# Altium project LimeSDR-X3_1v2.PrjPcb (part 5 of 20)

## Sheet 11_LMS1_Power.SchDoc: LMS7002M power supply (LMS1)
size A3; Organization: Lime Microsystems; Address1: Surrey Tech Centre; Address2: Guildford GU2 7YG; Address3: Surrey; Address4: United Kingdom; Revision: 1.2; SheetNumber: 10; SheetTotal: 31
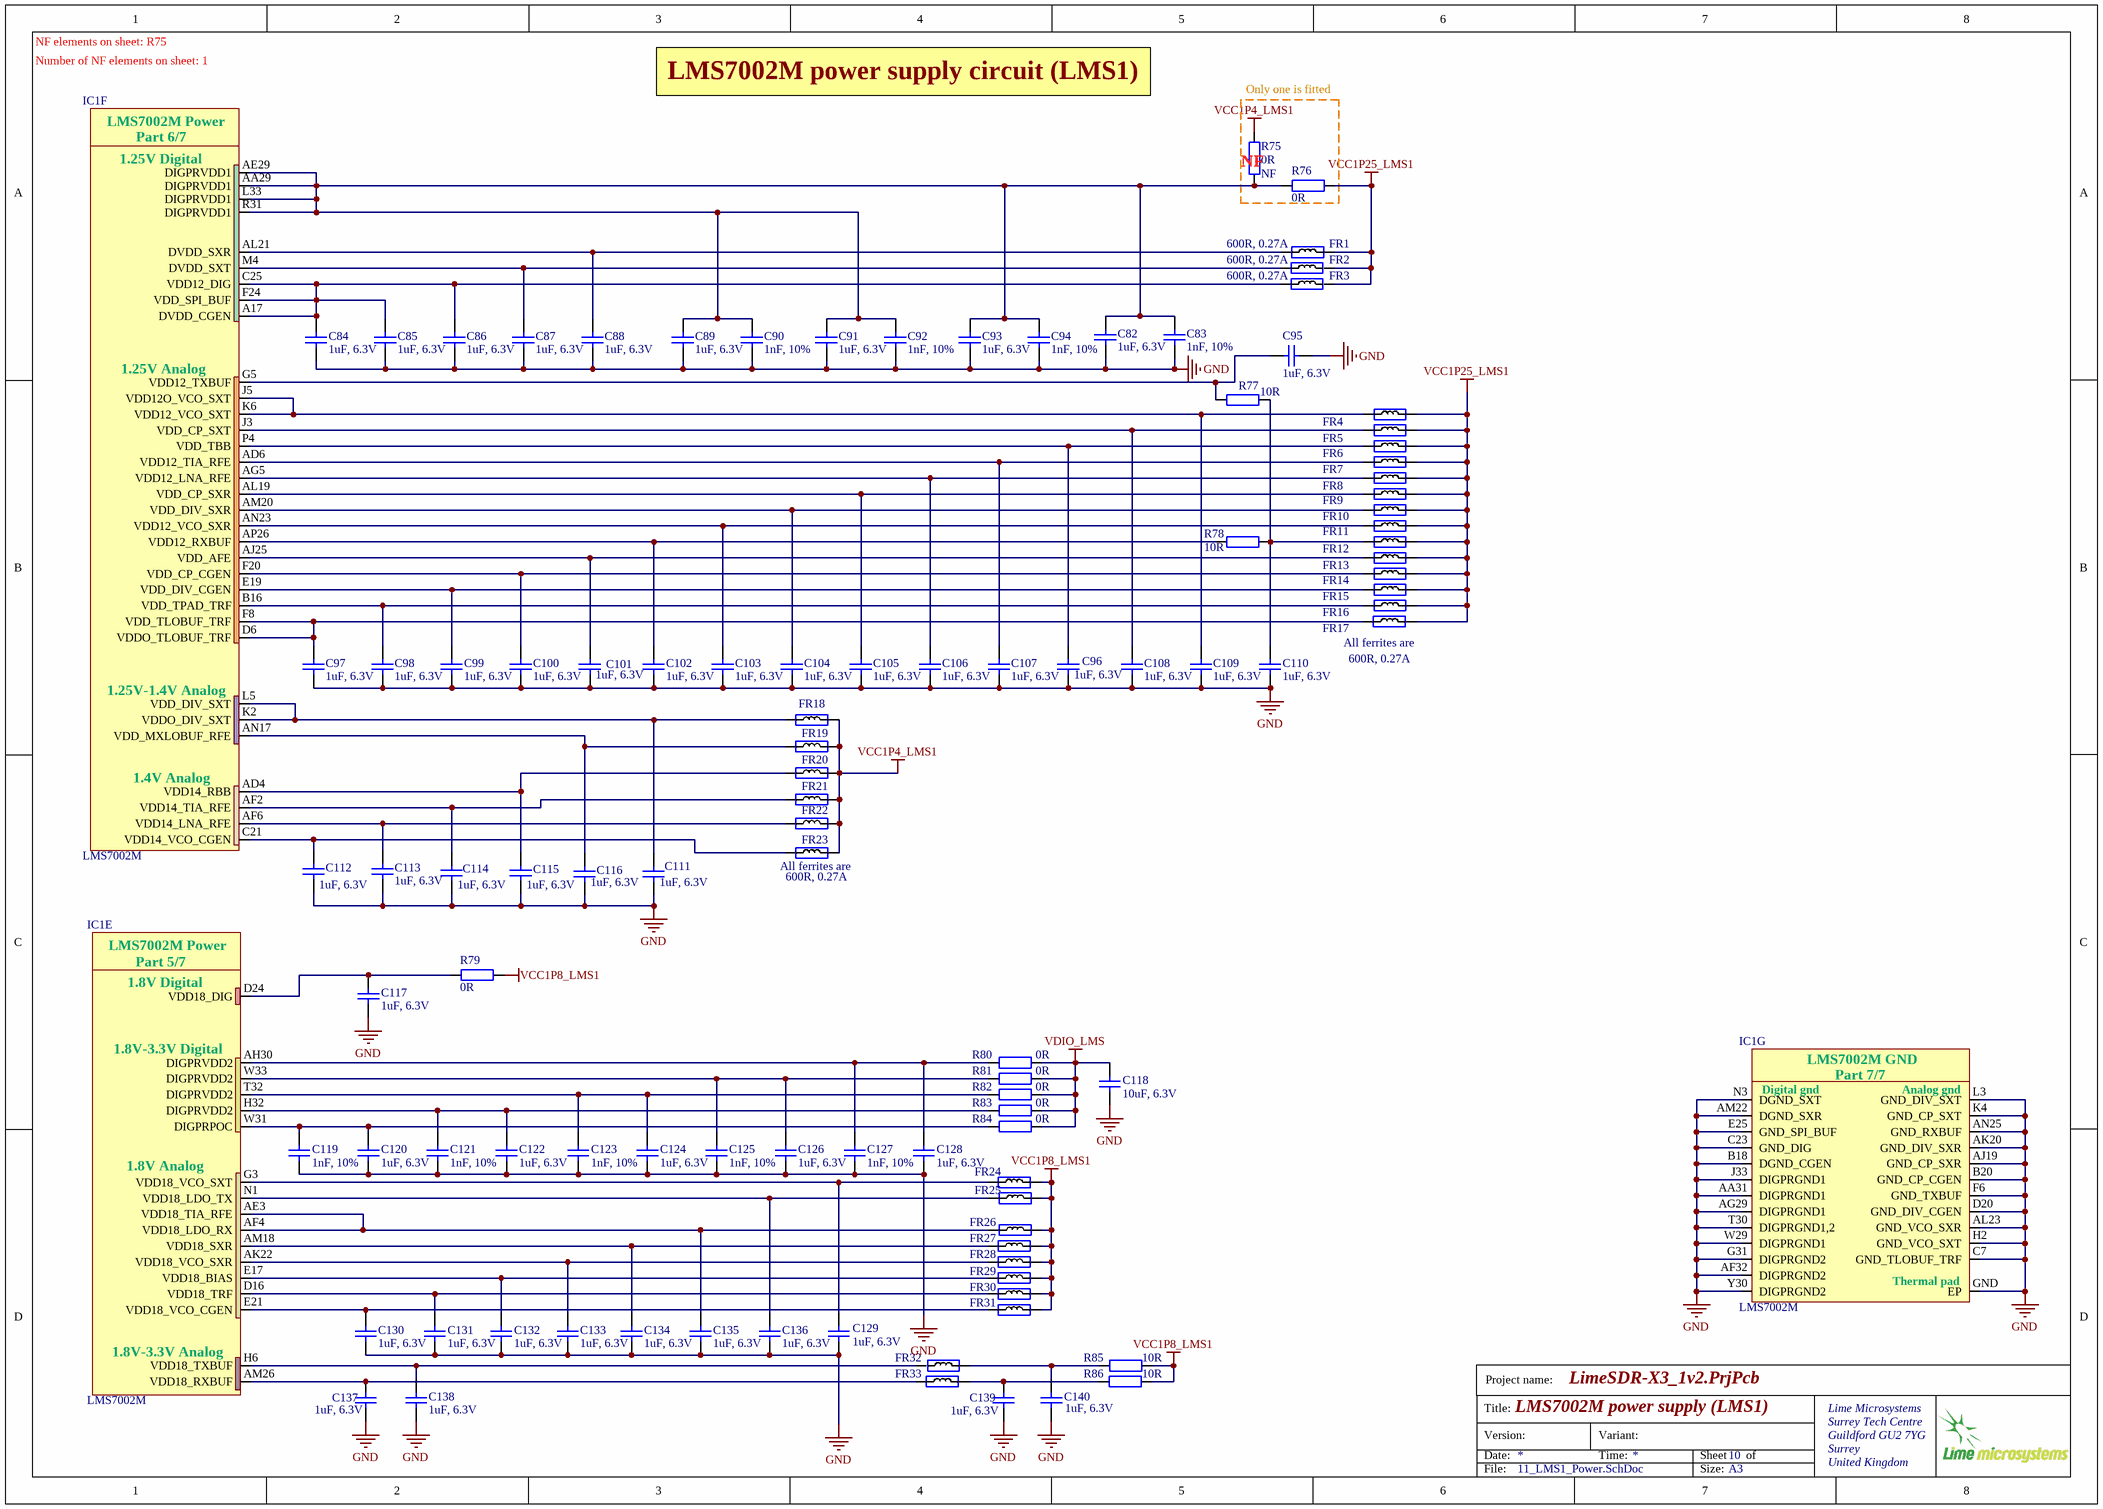
[diagram p10: 11_LMS1_Power.SchDoc]

### Parts
C82  1uF, 6.3V  [CAP0201]
C83  1nF, 10%  [CAP0201]
C84  1uF, 6.3V  [CAP0201]
C85  1uF, 6.3V  [CAP0201]
C86  1uF, 6.3V  [CAP0201]
C87  1uF, 6.3V  [CAP0201]
C88  1uF, 6.3V  [CAP0201]
C89  1uF, 6.3V  [CAP0201]
C90  1nF, 10%  [CAP0201]
C91  1uF, 6.3V  [CAP0201]
C92  1nF, 10%  [CAP0201]
C93  1uF, 6.3V  [CAP0201]
C94  1nF, 10%  [CAP0201]
C95  1uF, 6.3V  [CAP0201]
C96  1uF, 6.3V  [CAP0201]
C97  1uF, 6.3V  [CAP0201]
C98  1uF, 6.3V  [CAP0201]
C99  1uF, 6.3V  [CAP0201]
C100  1uF, 6.3V  [CAP0201]
C101  1uF, 6.3V  [CAP0201]
C102  1uF, 6.3V  [CAP0201]
C103  1uF, 6.3V  [CAP0201]
C104  1uF, 6.3V  [CAP0201]
C105  1uF, 6.3V  [CAP0201]
C106  1uF, 6.3V  [CAP0201]
C107  1uF, 6.3V  [CAP0201]
C108  1uF, 6.3V  [CAP0201]
C109  1uF, 6.3V  [CAP0201]
C110  1uF, 6.3V  [CAP0201]
C111  1uF, 6.3V  [CAP0201]
C112  1uF, 6.3V  [CAP0201]
C113  1uF, 6.3V  [CAP0201]
C114  1uF, 6.3V  [CAP0201]
C115  1uF, 6.3V  [CAP0201]
C116  1uF, 6.3V  [CAP0201]
C117  1uF, 6.3V  [CAP0201]
C118  10uF, 6.3V  [CAP0603]
C119  1nF, 10%  [CAP0201]
C120  1uF, 6.3V  [CAP0201]
C121  1nF, 10%  [CAP0201]
C122  1uF, 6.3V  [CAP0201]
C123  1nF, 10%  [CAP0201]
C124  1uF, 6.3V  [CAP0201]
C125  1nF, 10%  [CAP0201]
C126  1uF, 6.3V  [CAP0201]
C127  1nF, 10%  [CAP0201]
C128  1uF, 6.3V  [CAP0201]
C129  1uF, 6.3V  [CAP0201]
C130  1uF, 6.3V  [CAP0201]
C131  1uF, 6.3V  [CAP0201]
C132  1uF, 6.3V  [CAP0201]
C133  1uF, 6.3V  [CAP0201]
C134  1uF, 6.3V  [CAP0201]
C135  1uF, 6.3V  [CAP0201]
C136  1uF, 6.3V  [CAP0201]
C137  1uF, 6.3V  [CAP0201]
C138  1uF, 6.3V  [CAP0201]
C139  1uF, 6.3V  [CAP0201]
C140  1uF, 6.3V  [CAP0201]
FR1  600R, 0.27A  [RES0201]
FR2  600R, 0.27A  [RES0201]
FR3  600R, 0.27A  [RES0201]
FR4  600R, 0.27A  [RES0201]  (value not drawn)
FR5  600R, 0.27A  [RES0201]  (value not drawn)
FR6  600R, 0.27A  [RES0201]  (value not drawn)
FR7  600R, 0.27A  [RES0201]  (value not drawn)
FR8  600R, 0.27A  [RES0201]  (value not drawn)
FR9  600R, 0.27A  [RES0201]  (value not drawn)
FR10  600R, 0.27A  [RES0201]  (value not drawn)
FR11  600R, 0.27A  [RES0201]  (value not drawn)
FR12  600R, 0.27A  [RES0201]  (value not drawn)
FR13  600R, 0.27A  [RES0201]  (value not drawn)
FR14  600R, 0.27A  [RES0201]  (value not drawn)
FR15  600R, 0.27A  [RES0201]  (value not drawn)
FR16  600R, 0.27A  [RES0201]  (value not drawn)
FR17  600R, 0.27A  [RES0201]  (value not drawn)
FR18  600R, 0.27A  [RES0201]  (value not drawn)
FR19  600R, 0.27A  [RES0201]  (value not drawn)
FR20  600R, 0.27A  [RES0201]  (value not drawn)
FR21  600R, 0.27A  [RES0201]  (value not drawn)
FR22  600R, 0.27A  [RES0201]  (value not drawn)
FR23  600R, 0.27A  [RES0201]  (value not drawn)
FR24  600R, 0.27A  [RES0201]  (value not drawn)
FR25  600R, 0.27A  [RES0201]  (value not drawn)
FR26  600R, 0.27A  [RES0201]  (value not drawn)
FR27  600R, 0.27A  [RES0201]  (value not drawn)
FR28  600R, 0.27A  [RES0201]  (value not drawn)
FR29  600R, 0.27A  [RES0201]  (value not drawn)
FR30  600R, 0.27A  [RES0201]  (value not drawn)
FR31  600R, 0.27A  [RES0201]  (value not drawn)
FR32  600R, 0.27A  [RES0201]  (value not drawn)
FR33  600R, 0.27A  [RES0201]  (value not drawn)
IC1  LMS7002M  [LMS7002M_v5]  (parts E,F,G of 7)
R75  0R  Assembly Info: NF  [RES0402]
R76  0R  [RES0402]
R77  10R  [RES0201]
R78  10R  [RES0201]
R79  0R  [RES0201]
R80  0R  [RES0402]
R81  0R  [RES0402]
R82  0R  [RES0402]
R83  0R  [RES0402]
R84  0R  [RES0402]
R85  10R  [RES0201]
R86  10R  [RES0201]

### Blocks framed on the sheet
Only one is fitted: R75 R76

### Nets
GND: C82.2 C83.2 C84.2 C85.2 C86.2 C87.1 C88.2 C89.2 C90.2 C91.2 C92.2 C93.2 C94.2 C95.2 C96.2 C97.2 C98.2 C99.2 C100.1 C101.2 C102.2 C103.2 C104.2 C105.2 C106.2 C107.1 C108.2 C109.1 C110.1 C111.2 C112.2 C113.2 C114.2 C115.2 C116.2 C117.2 C118.1 C119.2 C120.2 C121.2 C122.2 C123.2 C124.2 C125.2 C126.2 C127.2 C128.2 C129.2 C130.2 C131.2 C132.2 C133.2 C134.2 C135.2 C136.2 C137.2 C138.2 C139.2 C140.2 IC1.AA31(DIGPRGND1) IC1.AF32(DIGPRGND2) IC1.AG29(DIGPRGND1) IC1.AJ19(GND_CP_SXR) IC1.AK20(GND_DIV_SXR) IC1.AL23(GND_VCO_SXR) IC1.AM22(DGND_SXR) IC1.AN25(GND_RXBUF) IC1.B18(DGND_CGEN) IC1.B20(GND_CP_CGEN) IC1.C7(GND_TLOBUF_TRF) IC1.C23(GND_DIG) IC1.D20(GND_DIV_CGEN) IC1.E25(GND_SPI_BUF) IC1.F6(GND_TXBUF) IC1.G31(DIGPRGND2) IC1.GND(EP) IC1.H2(GND_VCO_SXT) IC1.J33(DIGPRGND1) IC1.K4(GND_CP_SXT) IC1.L3(GND_DIV_SXT) IC1.N3(DGND_SXT) IC1.T30(DIGPRGND1,2) IC1.W29(DIGPRGND1) IC1.Y30(DIGPRGND2)
VCC1P4_LMS1: FR18.2 FR19.2 FR20.2 FR21.2 FR22.2 FR23.2 R75.1
VCC1P8_LMS1: FR24.2 FR25.1 FR26.1 FR27.2 FR28.2 FR29.2 FR30.2 FR31.2 R79.2 R85.2 R86.1
VCC1P25_LMS1: FR1.2 FR2.2 FR3.2 FR4.2 FR5.2 FR6.2 FR7.2 FR8.2 FR9.2 FR10.2 FR11.2 FR12.2 FR13.2 FR14.2 FR15.2 FR16.2 FR17.2 R76.1
VDIO_LMS: C118.2 R80.1 R81.1 R82.1 R83.1 R84.1
NetC82_1: C82.1 C83.1 C89.1 C90.1 C91.1 C92.1 C93.1 C94.1 IC1.AA29(DIGPRVDD1) IC1.AE29(DIGPRVDD1) IC1.L33(DIGPRVDD1) IC1.R31(DIGPRVDD1) R75.2 R76.2
NetC84_1: C84.1 C85.1 C86.1 FR3.1 IC1.A17(DVDD_CGEN) IC1.C25(VDD12_DIG) IC1.F24(VDD_SPI_BUF)
NetC87_2: C87.2 FR2.1 IC1.M4(DVDD_SXT)
NetC88_1: C88.1 FR1.1 IC1.AL21(DVDD_SXR)
NetC95_1: C95.1 IC1.G5(VDD12_TXBUF) R77.1
NetC96_1: C96.1 FR6.1 IC1.P4(VDD_TBB)
NetC97_1: C97.1 FR17.1 IC1.D6(VDDO_TLOBUF_TRF) IC1.F8(VDD_TLOBUF_TRF)
NetC98_1: C98.1 FR16.1 IC1.B16(VDD_TPAD_TRF)
NetC99_1: C99.1 FR15.1 IC1.E19(VDD_DIV_CGEN)
NetC100_2: C100.2 FR14.1 IC1.F20(VDD_CP_CGEN)
NetC101_1: C101.1 FR13.1 IC1.AJ25(VDD_AFE)
NetC102_1: C102.1 IC1.AP26(VDD12_RXBUF) R78.1
NetC103_1: C103.1 FR11.1 IC1.AN23(VDD12_VCO_SXR)
NetC104_1: C104.1 FR10.1 IC1.AM20(VDD_DIV_SXR)
NetC105_1: C105.1 FR9.1 IC1.AL19(VDD_CP_SXR)
NetC106_1: C106.1 FR8.1 IC1.AG5(VDD12_LNA_RFE)
NetC107_2: C107.2 FR7.1 IC1.AD6(VDD12_TIA_RFE)
NetC108_1: C108.1 FR5.1 IC1.J3(VDD_CP_SXT)
NetC109_2: C109.2 FR4.1 IC1.J5(VDD12O_VCO_SXT) IC1.K6(VDD12_VCO_SXT)
NetC110_2: C110.2 FR12.1 R77.2 R78.2
NetC111_1: C111.1 FR18.1 IC1.K2(VDDO_DIV_SXT) IC1.L5(VDD_DIV_SXT)
NetC112_1: C112.1 FR23.1 IC1.C21(VDD14_VCO_CGEN)
NetC113_1: C113.1 FR22.1 IC1.AF6(VDD14_LNA_RFE)
NetC114_1: C114.1 FR21.1 IC1.AF2(VDD14_TIA_RFE)
NetC115_1: C115.1 FR20.1 IC1.AD4(VDD14_RBB)
NetC116_1: C116.1 FR19.1 IC1.AN17(VDD_MXLOBUF_RFE)
NetC117_1: C117.1 IC1.D24(VDD18_DIG) R79.1
NetC119_1: C119.1 C120.1 IC1.W31(DIGPRPOC) R84.2
NetC121_1: C121.1 C122.1 IC1.H32(DIGPRVDD2) R83.2
NetC123_1: C123.1 C124.1 IC1.T32(DIGPRVDD2) R82.2
NetC125_1: C125.1 C126.1 IC1.W33(DIGPRVDD2) R81.2
NetC127_1: C127.1 C128.1 IC1.AH30(DIGPRVDD2) R80.2
NetC129_1: C129.1 FR24.1 IC1.G3(VDD18_VCO_SXT)
NetC130_1: C130.1 FR31.1 IC1.E21(VDD18_VCO_CGEN)
NetC131_1: C131.1 FR30.1 IC1.D16(VDD18_TRF)
NetC132_1: C132.1 FR29.1 IC1.E17(VDD18_BIAS)
NetC133_1: C133.1 FR28.1 IC1.AK22(VDD18_VCO_SXR)
NetC134_1: C134.1 FR27.1 IC1.AM18(VDD18_SXR)
NetC135_1: C135.1 FR26.2 IC1.AE3(VDD18_TIA_RFE) IC1.AF4(VDD18_LDO_RX)
NetC136_1: C136.1 FR25.2 IC1.N1(VDD18_LDO_TX)
NetC137_1: C137.1 FR33.1 IC1.AM26(VDD18_RXBUF)
NetC138_1: C138.1 FR32.2 IC1.H6(VDD18_TXBUF)
NetC139_1: C139.1 FR33.2 R86.2
NetC140_1: C140.1 FR32.1 R85.1

### Notes on the sheet
- NF elements on sheet: R75
- Number of NF elements on sheet: 1
- LMS7002M power supply circuit (LMS1)
- (near R75) NF
- (near FR17) All ferrites are
- 600R, 0.27A
- (near FR23) All ferrites are
- (near FR23) 600R, 0.27A
- Project name:
- Title:
- Version:
- Date:
- Variant:
- Time:
- Sheet
- of
- File:
- Size:
- A3
- (in symbol LMS7002Mr4, part E) LMS7002M Power; Part 5/7; 1.8V Digital; 1.8V-3.3V Digital; 1.8V Analog; 1.8V-3.3V Analog
- (in symbol LMS7002Mr4, part F) LMS7002M Power; Part 6/7; 1.25V Digital; 1.25V Analog; 1.25V-1.4V Analog; 1.4V Analog
- (in symbol LMS7002Mr4, part G) LMS7002M GND; Part 7/7; Digital gnd; Analog gnd; Thermal pad

### Library data of the parts
C82 C84-C89 C91 C93 C95-C117 C120 C122 C124 C126 C128-C140 = Cap_0402: Manufacturer: TDK Corporation; Manufacturer Part Number 1: JMK063ABJ105MP-F; Part Description: 1µF ±20% 6.3V X5R Ceramic Capacitor -55°C ~ 85°C Surface Mount, MLCC 0201 (0603 Metric) 0.024" L x 0.012" W (0.60mm x 0.30mm); Value: 1uF, 20%; Tolerance: ±20%; Capacitance: 1.0µF; Temperature Coefficient: X5R; Supplier 1: Digi-Key; Supplier Part Number 1: 587-5864-2-ND; Applications: General Purpose; Features: -; Lead Style: -; Ratings: -; Thickness (Max): -; Lead Spacing: -; Height - Seated (Max): -; Size / Dimension: 0.024" L x 0.012" W (0.60mm x 0.30mm); Mounting Type: Surface Mount, MLCC; Operating Temperature: -55°C ~ 85°C; Package / Case: 0201 (0603 Metric); Packaging: Cut Tape (CT); Voltage - Rated: 6.3V; Category: Capacitors; RoHS: RoHS Compliant
C83 C90 C92 C94 C119 C121 C123 C125 C127 = Cap_0402: Manufacturer Part Number 1: C0603X7R1E102K030BA; Manufacturer: TDK Corporation; Part Description: 1000pF ±10% 25V X7R Ceramic Capacitor -55°C ~ 125°C Surface Mount, MLCC 0201 (0603 Metric) 0.024" L x 0.012" W (0.60mm x 0.30mm); Voltage - Rated: 25V; Temperature Coefficient: X7R; Capacitance: 1000pF; Value: 1nF, 10%; Supplier 1: Digi-Key; Supplier Part Number 1: 445-7275-1-ND; Features: -; Package / Case: 0201 (0603 Metric); Lead Spacing: -; Mounting Type: Surface Mount, MLCC; Lead Style: -; Height - Seated (Max): -; Operating Temperature: -55°C ~ 125°C; Tolerance: ±10%; Size / Dimension: 0.024" L x 0.012" W (0.60mm x 0.30mm); Applications: General Purpose; Ratings: -; Thickness (Max): 0.013" (0.33mm); RoHS: RoHS Compliant; Packaging: Cut Tape (CT); Category: Capacitors
C118 = Cap_0603: Manufacturer Part Number 1: CC0603MRX5R5BB106; Manufacturer: Yageo; Part Description: 10µF ±20% 6.3V X5R Ceramic Capacitor -55°C ~ 85°C Surface Mount, MLCC 0603 (1608 Metric) 0.063" L x 0.031" W (1.60mm x 0.80mm); Capacitance: 10µF; Tolerance: ±20%; Supplier 1: Digi-Key; Supplier Part Number 1: 311-1448-2-ND; Package / Case: 0603 (1608 Metric); Category: Capacitors; Voltage - Rated: 6.3V; Value: 10uF, 6.3V
FR1-FR33 = Ferrite: Manufacturer Part Number 1: BK0603TS601-T; Manufacturer: Taiyo Yuden; Part Description: FERRITE BEAD 600 OHM 0201 1LN; DC Resistance (DCR): 750 mOhm Max; Filter Type: Differential Mode - Single; Impedance @ Frequency: 600 Ohm @ 100MHz; Current Rating: 270mA; Value: 600R@100MHz; Supplier 1: Digi-Key; Supplier Part Number 1: 587-3277-1-ND; Size / Dimension: 0.024" L x 0.012" W (0.60mm x 0.30mm); Package / Case: 0201 (0603 Metric); Height (Max): 0.013" (0.33mm); Mounting Type: Surface Mount; Packaging: Cut Tape (CT); RoHS: RoHS Compliant; Category: Filters
IC1 = LMS7002Mr4: as IC3 on sheet 09_LMS2_RF; Supplier 1: Lime Microsystems; Supplier Part Number 1: LMS7002M; Manufacturer Part Number 1: LMS7002M
R75 R76 R80-R84 = Res_0402: Manufacturer Part Number 1: RC0402JR-070RL; Manufacturer: Yageo; Part Description: RES SMD 0.0OHM JUMPER 1/16W 0402; Resistance (Ohms): 0.0; Tolerance: Jumper; Power (Watts): 0.063W, 1/16W; Value: 0R; Supplier 1: Digi-Key; Supplier Part Number 1: 311-0.0JRTR-ND; Category: Resistors; Temperature Coefficient: -; Features: Moisture Resistant; Supplier Device Package: 0402; Height: 0.016" (0.40mm); Package / Case: 0402 (1005 Metric); Operating Temperature: -55°C ~ 155°C; Size / Dimension: 0.039" L x 0.020" W (1.00mm x 0.50mm); Composition: Thick Film; Packaging: Tape & Reel (TR); Number of Terminations: 2; RoHS: RoHS Compliant
R77 R78 R85 R86 = Res_0402: Manufacturer: Panasonic Electronic Components; Part Description: RES SMD 10 OHM 1% 1/20W 0201; Manufacturer Part Number 1: ERJ-1GEF10R0C; Power (Watts): 0.05W, 1/20W; Resistance (Ohms): 10; Tolerance: ±1%; Temperature Coefficient: ±200ppm/°C; Value: 10R; Supplier 1: Digi-Key; Supplier Part Number 1: P10.0ABCT-ND; Package / Case: 0201 (0603 Metric); Height: 0.010" (0.26mm); Supplier Device Package: 0201; Packaging: Cut Tape (CT); Composition: Thick Film; Category: Resistors; Number of Terminations: 2; Size / Dimension: 0.024" L x 0.012" W (0.60mm x 0.30mm); Operating Temperature: -55°C ~ 125°C; Features: -; RoHS: RoHS Compliant
R79 = Res_0402: Manufacturer Part Number 1: RC0201FR-070RL; Manufacturer: Rohm Semiconductor; Part Description: RES SMD 0.0OHM JUMPER 1/20W 0201; Resistance (Ohms): 0.0; Power (Watts): 0.05W, 1/20W; Tolerance: Jumper; Value: 0R; Supplier 1: Digi-Key; Supplier Part Number 1: 311-0.0MCT-ND; Number of Terminations: 2; Operating Temperature: -55°C ~ 125°C; Package / Case: 0201 (0603 Metric); Height: 0.010" (0.26mm); Supplier Device Package: 0201 (0603 Metric); Size / Dimension: 0.024" L x 0.012" W (0.60mm x 0.30mm); Temperature Coefficient: -; Category: Resistors; Features: -; RoHS: RoHS Compliant; Composition: Thick Film; Packaging: Cut Tape (CT)

## Sheet 12_LMS2_Power.SchDoc: LMS7002M power supply (LMS2)
size A3; Organization: Lime Microsystems; Address1: Surrey Tech Centre; Address2: Guildford GU2 7YG; Address3: Surrey; Address4: United Kingdom; Revision: 1.2; SheetNumber: 10; SheetTotal: 31
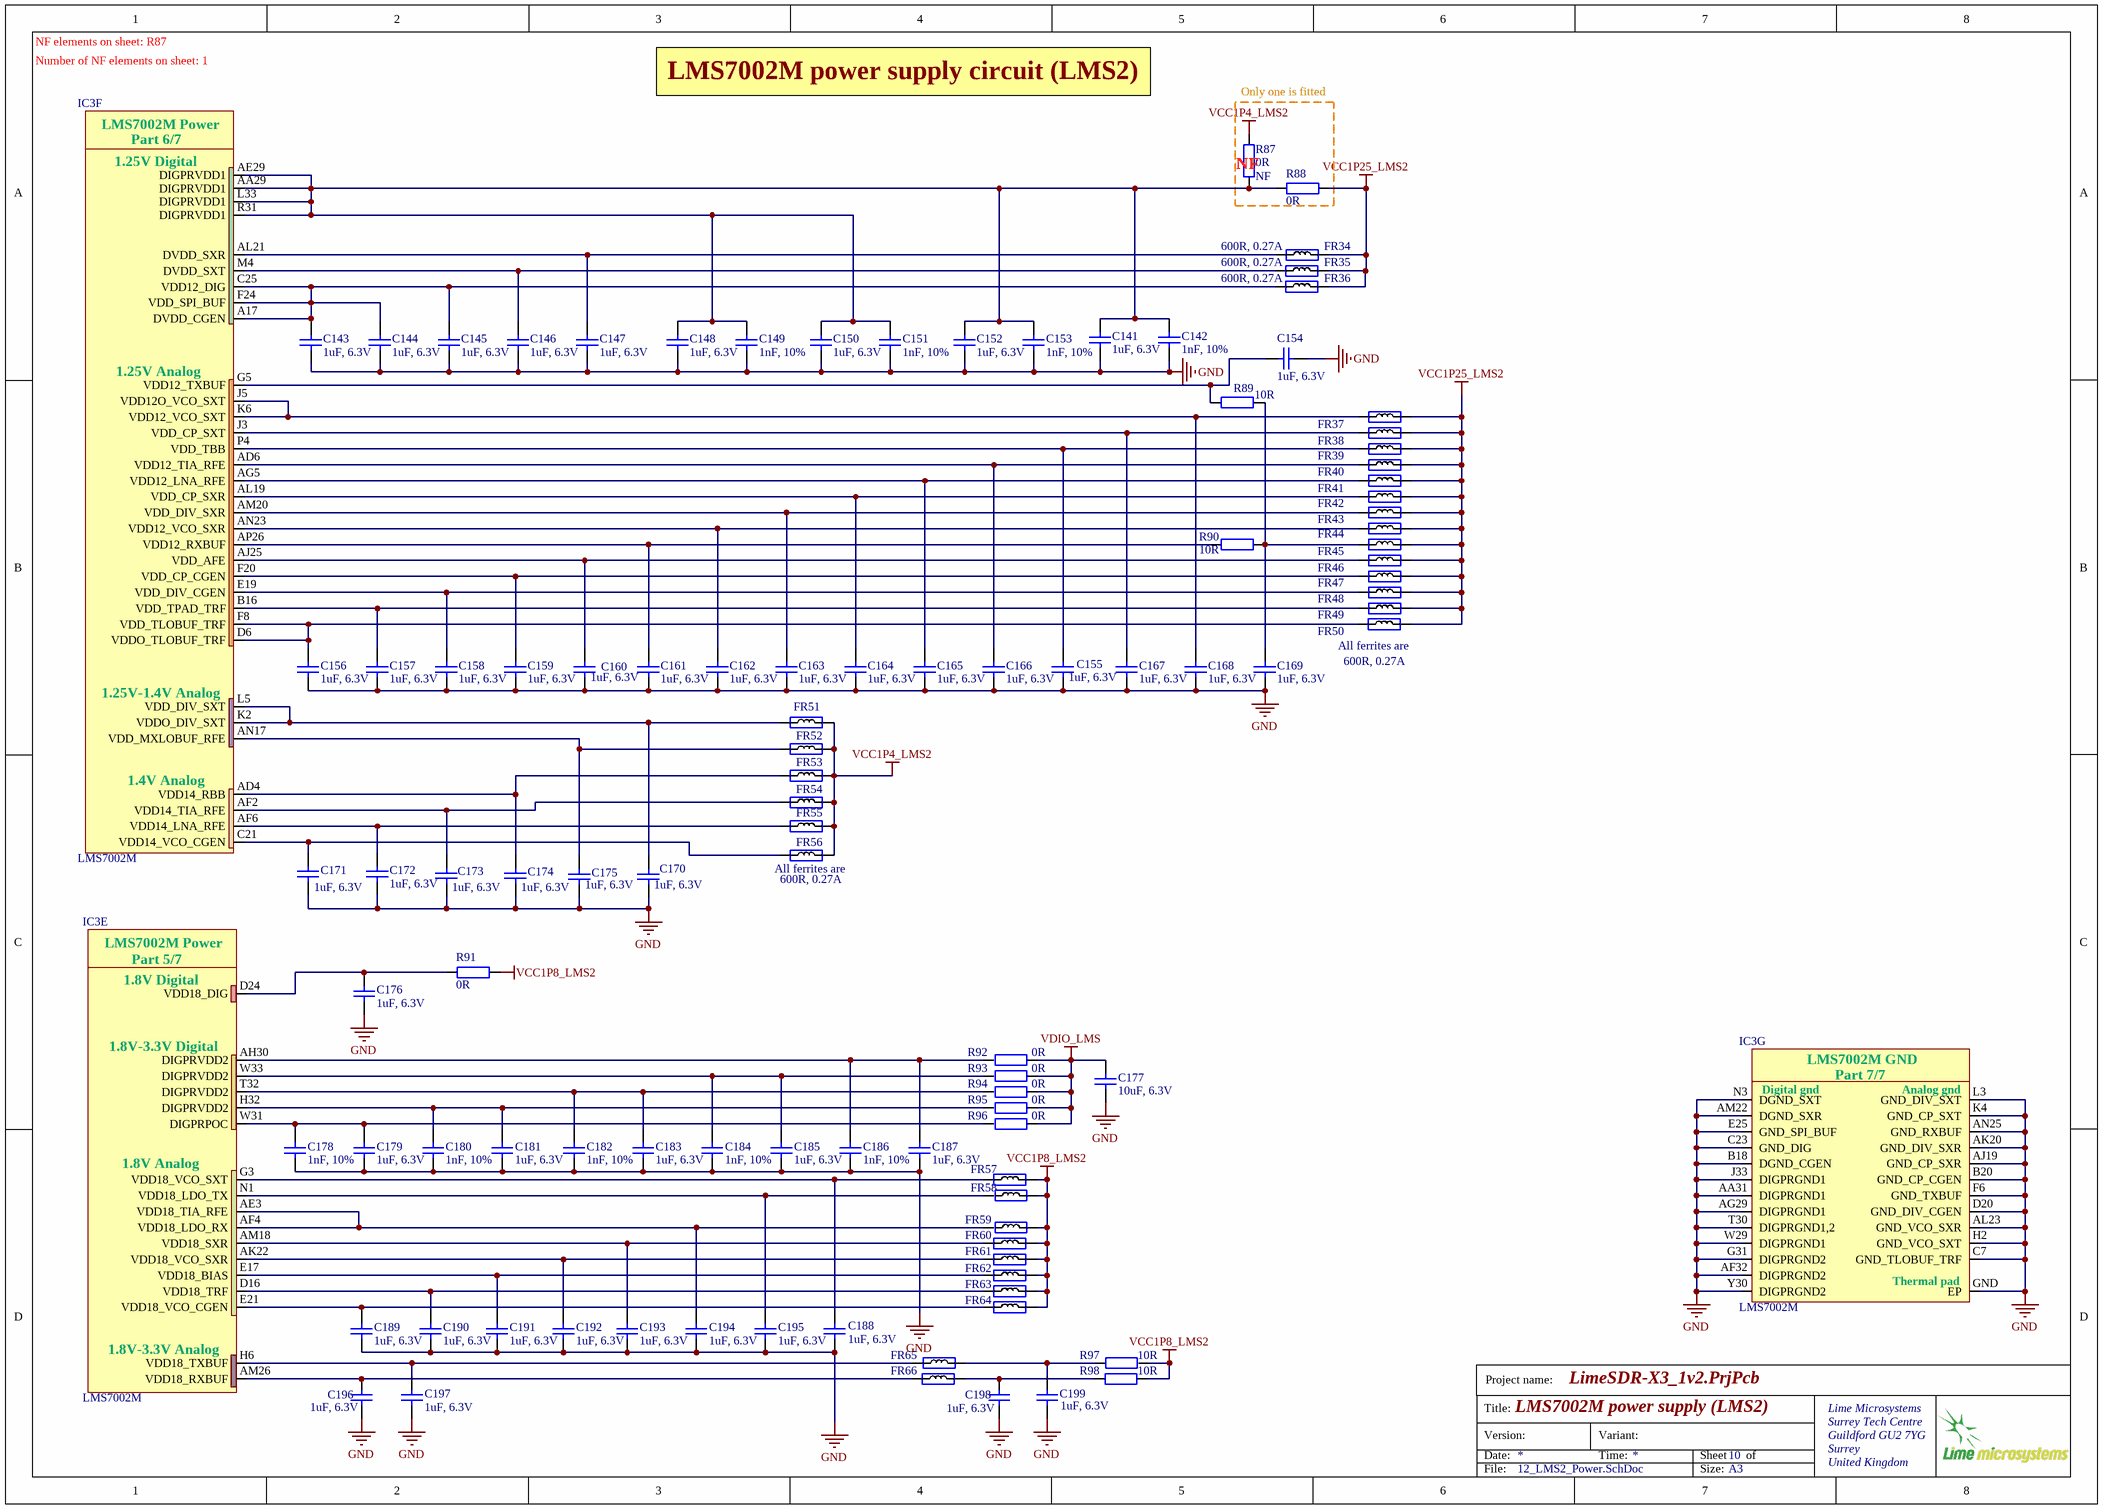
[diagram p11: 12_LMS2_Power.SchDoc]

### Parts
C141  1uF, 6.3V  [CAP0201]
C142  1nF, 10%  [CAP0201]
C143  1uF, 6.3V  [CAP0201]
C144  1uF, 6.3V  [CAP0201]
C145  1uF, 6.3V  [CAP0201]
C146  1uF, 6.3V  [CAP0201]
C147  1uF, 6.3V  [CAP0201]
C148  1uF, 6.3V  [CAP0201]
C149  1nF, 10%  [CAP0201]
C150  1uF, 6.3V  [CAP0201]
C151  1nF, 10%  [CAP0201]
C152  1uF, 6.3V  [CAP0201]
C153  1nF, 10%  [CAP0201]
C154  1uF, 6.3V  [CAP0201]
C155  1uF, 6.3V  [CAP0201]
C156  1uF, 6.3V  [CAP0201]
C157  1uF, 6.3V  [CAP0201]
C158  1uF, 6.3V  [CAP0201]
C159  1uF, 6.3V  [CAP0201]
C160  1uF, 6.3V  [CAP0201]
C161  1uF, 6.3V  [CAP0201]
C162  1uF, 6.3V  [CAP0201]
C163  1uF, 6.3V  [CAP0201]
C164  1uF, 6.3V  [CAP0201]
C165  1uF, 6.3V  [CAP0201]
C166  1uF, 6.3V  [CAP0201]
C167  1uF, 6.3V  [CAP0201]
C168  1uF, 6.3V  [CAP0201]
C169  1uF, 6.3V  [CAP0201]
C170  1uF, 6.3V  [CAP0201]
C171  1uF, 6.3V  [CAP0201]
C172  1uF, 6.3V  [CAP0201]
C173  1uF, 6.3V  [CAP0201]
C174  1uF, 6.3V  [CAP0201]
C175  1uF, 6.3V  [CAP0201]
C176  1uF, 6.3V  [CAP0201]
C177  10uF, 6.3V  [CAP0603]
C178  1nF, 10%  [CAP0201]
C179  1uF, 6.3V  [CAP0201]
C180  1nF, 10%  [CAP0201]
C181  1uF, 6.3V  [CAP0201]
C182  1nF, 10%  [CAP0201]
C183  1uF, 6.3V  [CAP0201]
C184  1nF, 10%  [CAP0201]
C185  1uF, 6.3V  [CAP0201]
C186  1nF, 10%  [CAP0201]
C187  1uF, 6.3V  [CAP0201]
C188  1uF, 6.3V  [CAP0201]
C189  1uF, 6.3V  [CAP0201]
C190  1uF, 6.3V  [CAP0201]
C191  1uF, 6.3V  [CAP0201]
C192  1uF, 6.3V  [CAP0201]
C193  1uF, 6.3V  [CAP0201]
C194  1uF, 6.3V  [CAP0201]
C195  1uF, 6.3V  [CAP0201]
C196  1uF, 6.3V  [CAP0201]
C197  1uF, 6.3V  [CAP0201]
C198  1uF, 6.3V  [CAP0201]
C199  1uF, 6.3V  [CAP0201]
FR34  600R, 0.27A  [RES0201]
FR35  600R, 0.27A  [RES0201]
FR36  600R, 0.27A  [RES0201]
FR37  600R, 0.27A  [RES0201]  (value not drawn)
FR38  600R, 0.27A  [RES0201]  (value not drawn)
FR39  600R, 0.27A  [RES0201]  (value not drawn)
FR40  600R, 0.27A  [RES0201]  (value not drawn)
FR41  600R, 0.27A  [RES0201]  (value not drawn)
FR42  600R, 0.27A  [RES0201]  (value not drawn)
FR43  600R, 0.27A  [RES0201]  (value not drawn)
FR44  600R, 0.27A  [RES0201]  (value not drawn)
FR45  600R, 0.27A  [RES0201]  (value not drawn)
FR46  600R, 0.27A  [RES0201]  (value not drawn)
FR47  600R, 0.27A  [RES0201]  (value not drawn)
FR48  600R, 0.27A  [RES0201]  (value not drawn)
FR49  600R, 0.27A  [RES0201]  (value not drawn)
FR50  600R, 0.27A  [RES0201]  (value not drawn)
FR51  600R, 0.27A  [RES0201]  (value not drawn)
FR52  600R, 0.27A  [RES0201]  (value not drawn)
FR53  600R, 0.27A  [RES0201]  (value not drawn)
FR54  600R, 0.27A  [RES0201]  (value not drawn)
FR55  600R, 0.27A  [RES0201]  (value not drawn)
FR56  600R, 0.27A  [RES0201]  (value not drawn)
FR57  600R, 0.27A  [RES0201]  (value not drawn)
FR58  600R, 0.27A  [RES0201]  (value not drawn)
FR59  600R, 0.27A  [RES0201]  (value not drawn)
FR60  600R, 0.27A  [RES0201]  (value not drawn)
FR61  600R, 0.27A  [RES0201]  (value not drawn)
FR62  600R, 0.27A  [RES0201]  (value not drawn)
FR63  600R, 0.27A  [RES0201]  (value not drawn)
FR64  600R, 0.27A  [RES0201]  (value not drawn)
FR65  600R, 0.27A  [RES0201]  (value not drawn)
FR66  600R, 0.27A  [RES0201]  (value not drawn)
IC3  LMS7002M  [LMS7002M_v5]  (parts E,F,G of 7)
R87  0R  Assembly Info: NF  [RES0402]
R88  0R  [RES0402]
R89  10R  [RES0201]
R90  10R  [RES0201]
R91  0R  [RES0201]
R92  0R  [RES0402]
R93  0R  [RES0402]
R94  0R  [RES0402]
R95  0R  [RES0402]
R96  0R  [RES0402]
R97  10R  [RES0201]
R98  10R  [RES0201]

### Blocks framed on the sheet
Only one is fitted: R87 R88

### Nets
GND: C141.2 C142.2 C143.2 C144.2 C145.2 C146.1 C147.2 C148.2 C149.2 C150.2 C151.2 C152.2 C153.2 C154.2 C155.2 C156.2 C157.2 C158.2 C159.1 C160.2 C161.2 C162.2 C163.2 C164.2 C165.2 C166.1 C167.2 C168.1 C169.1 C170.2 C171.2 C172.2 C173.2 C174.2 C175.2 C176.2 C177.1 C178.2 C179.2 C180.2 C181.2 C182.2 C183.2 C184.2 C185.2 C186.2 C187.2 C188.2 C189.2 C190.2 C191.2 C192.2 C193.2 C194.2 C195.2 C196.2 C197.2 C198.2 C199.2 IC3.AA31(DIGPRGND1) IC3.AF32(DIGPRGND2) IC3.AG29(DIGPRGND1) IC3.AJ19(GND_CP_SXR) IC3.AK20(GND_DIV_SXR) IC3.AL23(GND_VCO_SXR) IC3.AM22(DGND_SXR) IC3.AN25(GND_RXBUF) IC3.B18(DGND_CGEN) IC3.B20(GND_CP_CGEN) IC3.C7(GND_TLOBUF_TRF) IC3.C23(GND_DIG) IC3.D20(GND_DIV_CGEN) IC3.E25(GND_SPI_BUF) IC3.F6(GND_TXBUF) IC3.G31(DIGPRGND2) IC3.GND(EP) IC3.H2(GND_VCO_SXT) IC3.J33(DIGPRGND1) IC3.K4(GND_CP_SXT) IC3.L3(GND_DIV_SXT) IC3.N3(DGND_SXT) IC3.T30(DIGPRGND1,2) IC3.W29(DIGPRGND1) IC3.Y30(DIGPRGND2)
VCC1P4_LMS2: FR51.2 FR52.2 FR53.2 FR54.2 FR55.2 FR56.2 R87.1
VCC1P8_LMS2: FR57.2 FR58.1 FR59.1 FR60.2 FR61.2 FR62.2 FR63.2 FR64.2 R91.2 R97.2 R98.1
VCC1P25_LMS2: FR34.2 FR35.2 FR36.2 FR37.2 FR38.2 FR39.2 FR40.2 FR41.2 FR42.2 FR43.2 FR44.2 FR45.2 FR46.2 FR47.2 FR48.2 FR49.2 FR50.2 R88.1
VDIO_LMS: C177.2 R92.1 R93.1 R94.1 R95.1 R96.1
NetC141_1: C141.1 C142.1 C148.1 C149.1 C150.1 C151.1 C152.1 C153.1 IC3.AA29(DIGPRVDD1) IC3.AE29(DIGPRVDD1) IC3.L33(DIGPRVDD1) IC3.R31(DIGPRVDD1) R87.2 R88.2
NetC143_1: C143.1 C144.1 C145.1 FR36.1 IC3.A17(DVDD_CGEN) IC3.C25(VDD12_DIG) IC3.F24(VDD_SPI_BUF)
NetC146_2: C146.2 FR35.1 IC3.M4(DVDD_SXT)
NetC147_1: C147.1 FR34.1 IC3.AL21(DVDD_SXR)
NetC154_1: C154.1 IC3.G5(VDD12_TXBUF) R89.1
NetC155_1: C155.1 FR39.1 IC3.P4(VDD_TBB)
NetC156_1: C156.1 FR50.1 IC3.D6(VDDO_TLOBUF_TRF) IC3.F8(VDD_TLOBUF_TRF)
NetC157_1: C157.1 FR49.1 IC3.B16(VDD_TPAD_TRF)
NetC158_1: C158.1 FR48.1 IC3.E19(VDD_DIV_CGEN)
NetC159_2: C159.2 FR47.1 IC3.F20(VDD_CP_CGEN)
NetC160_1: C160.1 FR46.1 IC3.AJ25(VDD_AFE)
NetC161_1: C161.1 IC3.AP26(VDD12_RXBUF) R90.1
NetC162_1: C162.1 FR44.1 IC3.AN23(VDD12_VCO_SXR)
NetC163_1: C163.1 FR43.1 IC3.AM20(VDD_DIV_SXR)
NetC164_1: C164.1 FR42.1 IC3.AL19(VDD_CP_SXR)
NetC165_1: C165.1 FR41.1 IC3.AG5(VDD12_LNA_RFE)
NetC166_2: C166.2 FR40.1 IC3.AD6(VDD12_TIA_RFE)
NetC167_1: C167.1 FR38.1 IC3.J3(VDD_CP_SXT)
NetC168_2: C168.2 FR37.1 IC3.J5(VDD12O_VCO_SXT) IC3.K6(VDD12_VCO_SXT)
NetC169_2: C169.2 FR45.1 R89.2 R90.2
NetC170_1: C170.1 FR51.1 IC3.K2(VDDO_DIV_SXT) IC3.L5(VDD_DIV_SXT)
NetC171_1: C171.1 FR56.1 IC3.C21(VDD14_VCO_CGEN)
NetC172_1: C172.1 FR55.1 IC3.AF6(VDD14_LNA_RFE)
NetC173_1: C173.1 FR54.1 IC3.AF2(VDD14_TIA_RFE)
NetC174_1: C174.1 FR53.1 IC3.AD4(VDD14_RBB)
NetC175_1: C175.1 FR52.1 IC3.AN17(VDD_MXLOBUF_RFE)
NetC176_1: C176.1 IC3.D24(VDD18_DIG) R91.1
NetC178_1: C178.1 C179.1 IC3.W31(DIGPRPOC) R96.2
NetC180_1: C180.1 C181.1 IC3.H32(DIGPRVDD2) R95.2
NetC182_1: C182.1 C183.1 IC3.T32(DIGPRVDD2) R94.2
NetC184_1: C184.1 C185.1 IC3.W33(DIGPRVDD2) R93.2
NetC186_1: C186.1 C187.1 IC3.AH30(DIGPRVDD2) R92.2
NetC188_1: C188.1 FR57.1 IC3.G3(VDD18_VCO_SXT)
NetC189_1: C189.1 FR64.1 IC3.E21(VDD18_VCO_CGEN)
NetC190_1: C190.1 FR63.1 IC3.D16(VDD18_TRF)
NetC191_1: C191.1 FR62.1 IC3.E17(VDD18_BIAS)
NetC192_1: C192.1 FR61.1 IC3.AK22(VDD18_VCO_SXR)
NetC193_1: C193.1 FR60.1 IC3.AM18(VDD18_SXR)
NetC194_1: C194.1 FR59.2 IC3.AE3(VDD18_TIA_RFE) IC3.AF4(VDD18_LDO_RX)
NetC195_1: C195.1 FR58.2 IC3.N1(VDD18_LDO_TX)
NetC196_1: C196.1 FR66.1 IC3.AM26(VDD18_RXBUF)
NetC197_1: C197.1 FR65.2 IC3.H6(VDD18_TXBUF)
NetC198_1: C198.1 FR66.2 R98.2
NetC199_1: C199.1 FR65.1 R97.1

### Notes on the sheet
- NF elements on sheet: R87
- Number of NF elements on sheet: 1
- LMS7002M power supply circuit (LMS2)
- (near R87) NF
- (near FR50) All ferrites are
- 600R, 0.27A
- (near FR56) All ferrites are
- (near FR56) 600R, 0.27A
- Project name:
- Title:
- Version:
- Date:
- Variant:
- Time:
- Sheet
- of
- File:
- Size:
- A3
- (in symbol LMS7002Mr4, part E) LMS7002M Power; Part 5/7; 1.8V Digital; 1.8V-3.3V Digital; 1.8V Analog; 1.8V-3.3V Analog
- (in symbol LMS7002Mr4, part F) LMS7002M Power; Part 6/7; 1.25V Digital; 1.25V Analog; 1.25V-1.4V Analog; 1.4V Analog
- (in symbol LMS7002Mr4, part G) LMS7002M GND; Part 7/7; Digital gnd; Analog gnd; Thermal pad

### Library data of the parts
C141 C143-C148 C150 C152 C154-C176 C179 C181 C183 C185 C187-C199 = Cap_0402: as C82 on sheet 11_LMS1_Power; Supplier 1: Digi-Key; Supplier Part Number 1: 587-5864-2-ND; Applications: General Purpose; Features: -; Lead Style: -; Ratings: -; Thickness (Max): -; Lead Spacing: -; Height - Seated (Max): -; Size / Dimension: 0.024" L x 0.012" W (0.60mm x 0.30mm); Mounting Type: Surface Mount, MLCC; Operating Temperature: -55°C ~ 85°C; Package / Case: 0201 (0603 Metric); Packaging: Cut Tape (CT); Voltage - Rated: 6.3V; Category: Capacitors; RoHS: RoHS Compliant
C142 C149 C151 C153 C178 C180 C182 C184 C186 = Cap_0402: as C83 on sheet 11_LMS1_Power; Value: 1nF, 10%; Supplier 1: Digi-Key; Supplier Part Number 1: 445-7275-1-ND; Features: -; Package / Case: 0201 (0603 Metric); Lead Spacing: -; Mounting Type: Surface Mount, MLCC; Lead Style: -; Height - Seated (Max): -; Operating Temperature: -55°C ~ 125°C; Tolerance: ±10%; Size / Dimension: 0.024" L x 0.012" W (0.60mm x 0.30mm); Applications: General Purpose; Ratings: -; Thickness (Max): 0.013" (0.33mm); RoHS: RoHS Compliant; Packaging: Cut Tape (CT); Category: Capacitors
C177 = Cap_0603: as C118 on sheet 11_LMS1_Power; Supplier 1: Digi-Key; Supplier Part Number 1: 311-1448-2-ND; Package / Case: 0603 (1608 Metric); Category: Capacitors; Voltage - Rated: 6.3V; Value: 10uF, 6.3V
FR34-FR66 = Ferrite: as FR1 on sheet 11_LMS1_Power; Supplier 1: Digi-Key; Supplier Part Number 1: 587-3277-1-ND; Size / Dimension: 0.024" L x 0.012" W (0.60mm x 0.30mm); Package / Case: 0201 (0603 Metric); Height (Max): 0.013" (0.33mm); Mounting Type: Surface Mount; Packaging: Cut Tape (CT); RoHS: RoHS Compliant; Category: Filters
IC3 = LMS7002Mr4: as IC3 on sheet 09_LMS2_RF; Supplier 1: Lime Microsystems; Supplier Part Number 1: LMS7002M; Manufacturer Part Number 1: LMS7002M
R87 R88 R92-R96 = Res_0402: as R75 on sheet 11_LMS1_Power; Value: 0R; Supplier 1: Digi-Key; Supplier Part Number 1: 311-0.0JRTR-ND; Category: Resistors; Temperature Coefficient: -; Features: Moisture Resistant; Supplier Device Package: 0402; Height: 0.016" (0.40mm); Package / Case: 0402 (1005 Metric); Operating Temperature: -55°C ~ 155°C; Size / Dimension: 0.039" L x 0.020" W (1.00mm x 0.50mm); Composition: Thick Film; Packaging: Tape & Reel (TR); Number of Terminations: 2; RoHS: RoHS Compliant
R89 R90 R97 R98 = Res_0402: as R77 on sheet 11_LMS1_Power; Value: 10R; Supplier 1: Digi-Key; Supplier Part Number 1: P10.0ABCT-ND; Package / Case: 0201 (0603 Metric); Height: 0.010" (0.26mm); Supplier Device Package: 0201; Packaging: Cut Tape (CT); Composition: Thick Film; Category: Resistors; Number of Terminations: 2; Size / Dimension: 0.024" L x 0.012" W (0.60mm x 0.30mm); Operating Temperature: -55°C ~ 125°C; Features: -; RoHS: RoHS Compliant
R91 = Res_0402: as R79 on sheet 11_LMS1_Power; Value: 0R; Supplier 1: Digi-Key; Supplier Part Number 1: 311-0.0MCT-ND; Number of Terminations: 2; Operating Temperature: -55°C ~ 125°C; Package / Case: 0201 (0603 Metric); Height: 0.010" (0.26mm); Supplier Device Package: 0201 (0603 Metric); Size / Dimension: 0.024" L x 0.012" W (0.60mm x 0.30mm); Temperature Coefficient: -; Category: Resistors; Features: -; RoHS: RoHS Compliant; Composition: Thick Film; Packaging: Cut Tape (CT)

## Sheet 13_LMS3_Power.SchDoc: LMS7002M power supply (LMS3)
size A3; Organization: Lime Microsystems; Address1: Surrey Tech Centre; Address2: Guildford GU2 7YG; Address3: Surrey; Address4: United Kingdom; Revision: 1.2; SheetNumber: 10; SheetTotal: 31
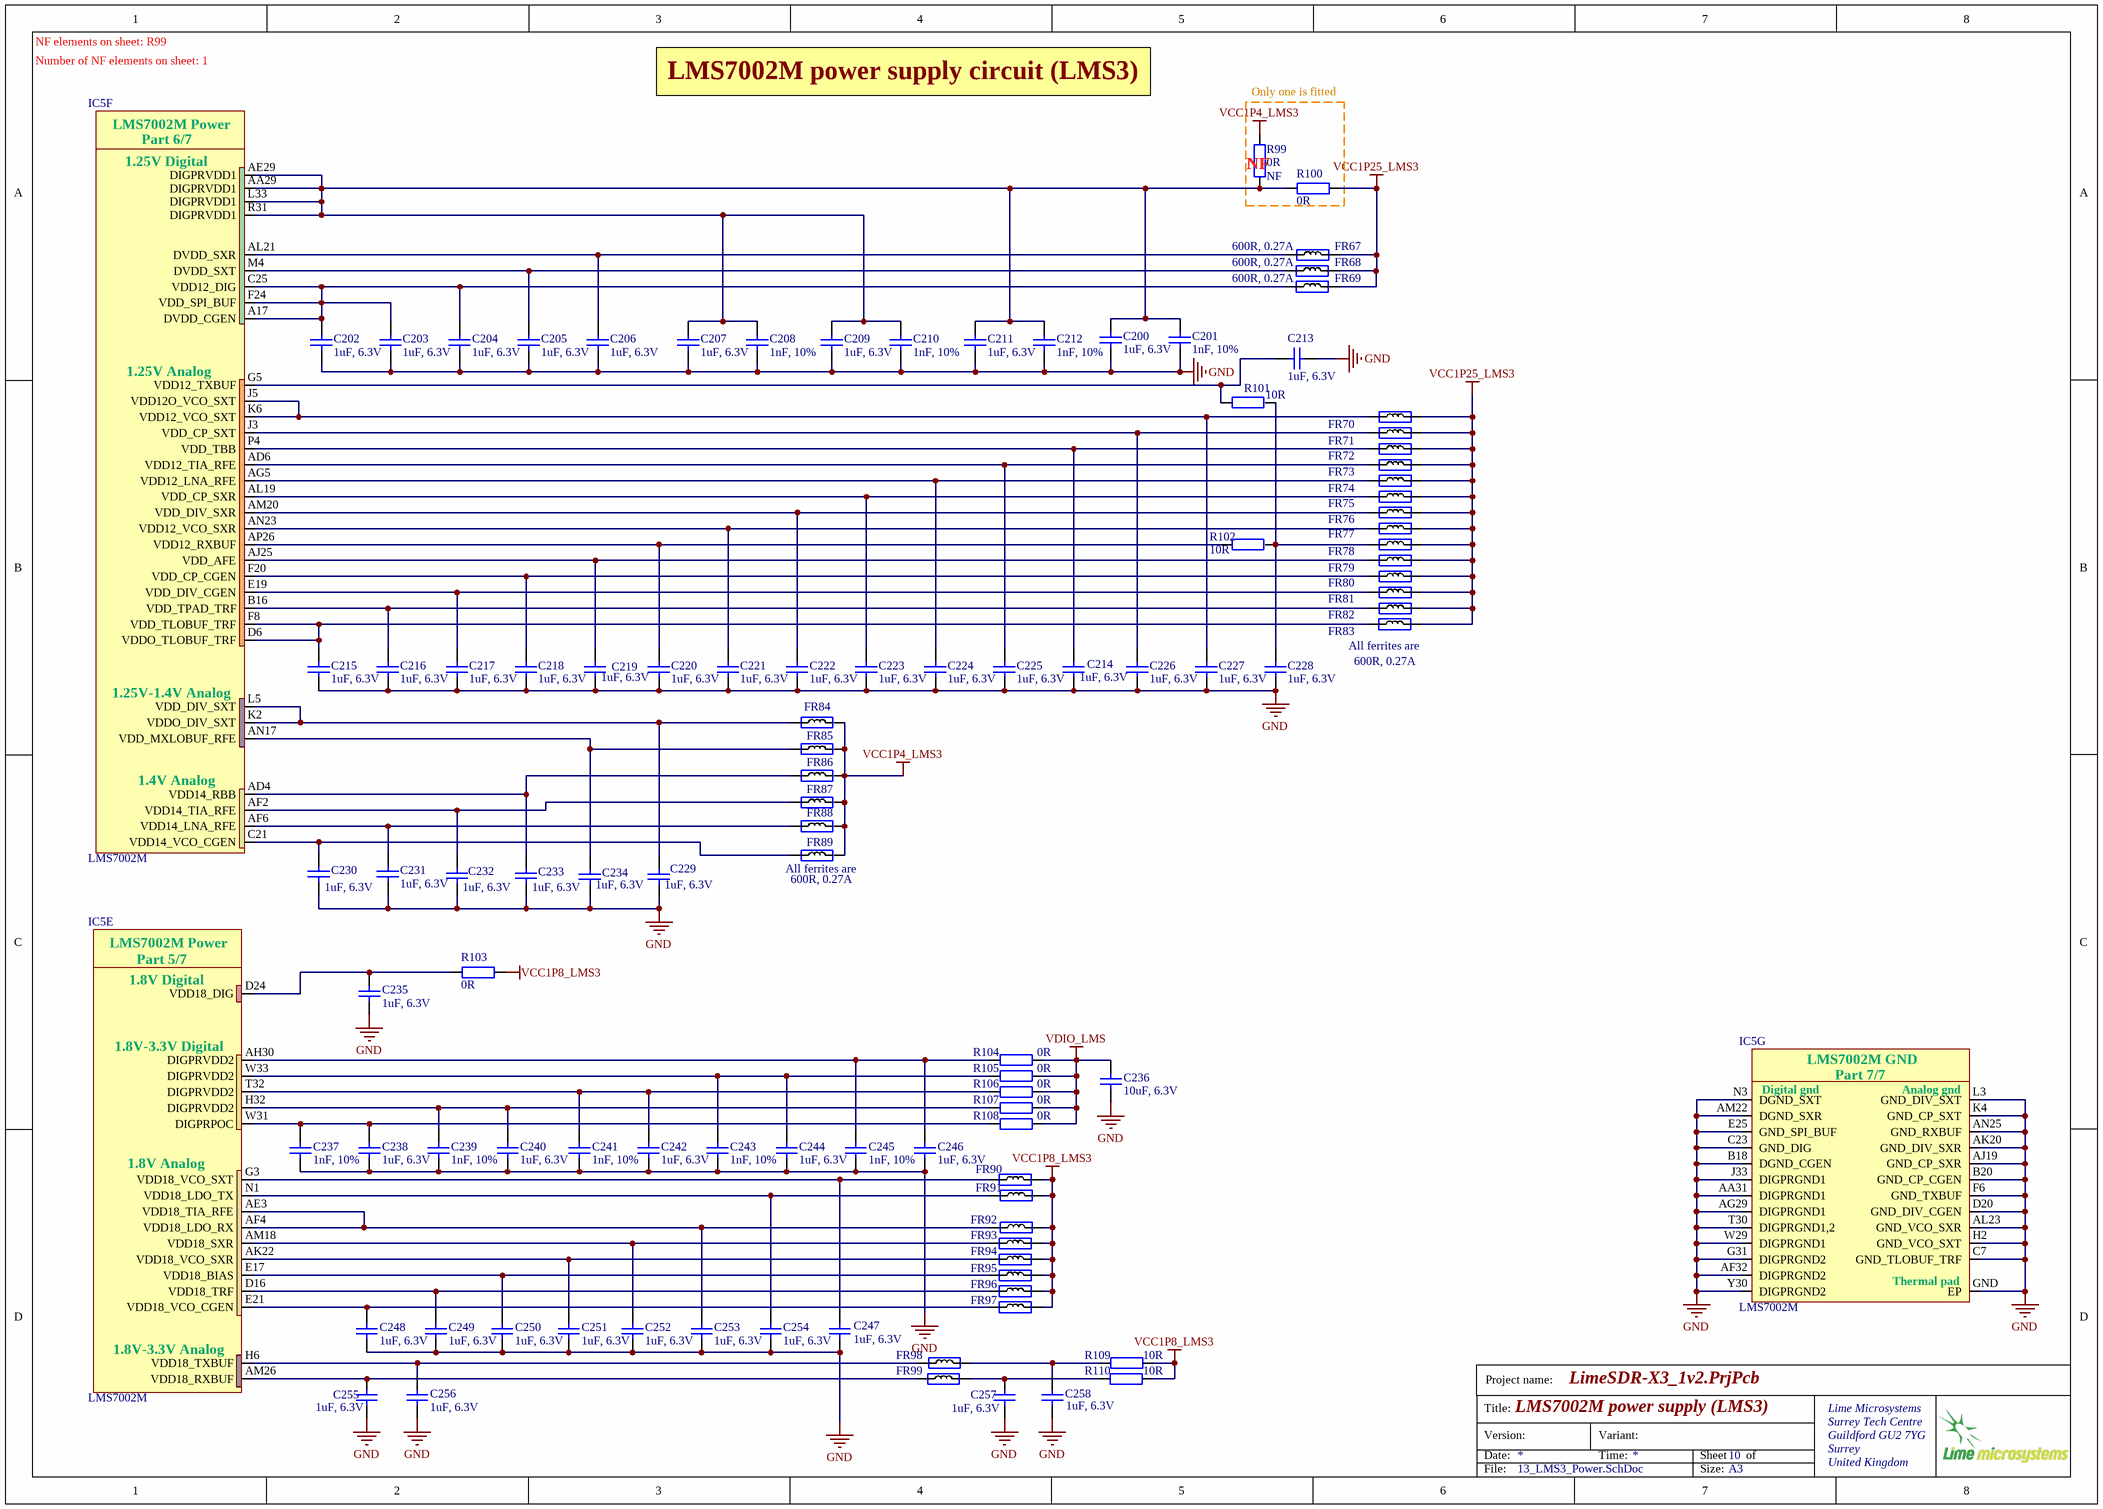
[diagram p12: 13_LMS3_Power.SchDoc]

### Parts
C200  1uF, 6.3V  [CAP0201]
C201  1nF, 10%  [CAP0201]
C202  1uF, 6.3V  [CAP0201]
C203  1uF, 6.3V  [CAP0201]
C204  1uF, 6.3V  [CAP0201]
C205  1uF, 6.3V  [CAP0201]
C206  1uF, 6.3V  [CAP0201]
C207  1uF, 6.3V  [CAP0201]
C208  1nF, 10%  [CAP0201]
C209  1uF, 6.3V  [CAP0201]
C210  1nF, 10%  [CAP0201]
C211  1uF, 6.3V  [CAP0201]
C212  1nF, 10%  [CAP0201]
C213  1uF, 6.3V  [CAP0201]
C214  1uF, 6.3V  [CAP0201]
C215  1uF, 6.3V  [CAP0201]
C216  1uF, 6.3V  [CAP0201]
C217  1uF, 6.3V  [CAP0201]
C218  1uF, 6.3V  [CAP0201]
C219  1uF, 6.3V  [CAP0201]
C220  1uF, 6.3V  [CAP0201]
C221  1uF, 6.3V  [CAP0201]
C222  1uF, 6.3V  [CAP0201]
C223  1uF, 6.3V  [CAP0201]
C224  1uF, 6.3V  [CAP0201]
C225  1uF, 6.3V  [CAP0201]
C226  1uF, 6.3V  [CAP0201]
C227  1uF, 6.3V  [CAP0201]
C228  1uF, 6.3V  [CAP0201]
C229  1uF, 6.3V  [CAP0201]
C230  1uF, 6.3V  [CAP0201]
C231  1uF, 6.3V  [CAP0201]
C232  1uF, 6.3V  [CAP0201]
C233  1uF, 6.3V  [CAP0201]
C234  1uF, 6.3V  [CAP0201]
C235  1uF, 6.3V  [CAP0201]
C236  10uF, 6.3V  [CAP0603]
C237  1nF, 10%  [CAP0201]
C238  1uF, 6.3V  [CAP0201]
C239  1nF, 10%  [CAP0201]
C240  1uF, 6.3V  [CAP0201]
C241  1nF, 10%  [CAP0201]
C242  1uF, 6.3V  [CAP0201]
C243  1nF, 10%  [CAP0201]
C244  1uF, 6.3V  [CAP0201]
C245  1nF, 10%  [CAP0201]
C246  1uF, 6.3V  [CAP0201]
C247  1uF, 6.3V  [CAP0201]
C248  1uF, 6.3V  [CAP0201]
C249  1uF, 6.3V  [CAP0201]
C250  1uF, 6.3V  [CAP0201]
C251  1uF, 6.3V  [CAP0201]
C252  1uF, 6.3V  [CAP0201]
C253  1uF, 6.3V  [CAP0201]
C254  1uF, 6.3V  [CAP0201]
C255  1uF, 6.3V  [CAP0201]
C256  1uF, 6.3V  [CAP0201]
C257  1uF, 6.3V  [CAP0201]
C258  1uF, 6.3V  [CAP0201]
FR67  600R, 0.27A  [RES0201]
FR68  600R, 0.27A  [RES0201]
FR69  600R, 0.27A  [RES0201]
FR70  600R, 0.27A  [RES0201]  (value not drawn)
FR71  600R, 0.27A  [RES0201]  (value not drawn)
FR72  600R, 0.27A  [RES0201]  (value not drawn)
FR73  600R, 0.27A  [RES0201]  (value not drawn)
FR74  600R, 0.27A  [RES0201]  (value not drawn)
FR75  600R, 0.27A  [RES0201]  (value not drawn)
FR76  600R, 0.27A  [RES0201]  (value not drawn)
FR77  600R, 0.27A  [RES0201]  (value not drawn)
FR78  600R, 0.27A  [RES0201]  (value not drawn)
FR79  600R, 0.27A  [RES0201]  (value not drawn)
FR80  600R, 0.27A  [RES0201]  (value not drawn)
FR81  600R, 0.27A  [RES0201]  (value not drawn)
FR82  600R, 0.27A  [RES0201]  (value not drawn)
FR83  600R, 0.27A  [RES0201]  (value not drawn)
FR84  600R, 0.27A  [RES0201]  (value not drawn)
FR85  600R, 0.27A  [RES0201]  (value not drawn)
FR86  600R, 0.27A  [RES0201]  (value not drawn)
FR87  600R, 0.27A  [RES0201]  (value not drawn)
FR88  600R, 0.27A  [RES0201]  (value not drawn)
FR89  600R, 0.27A  [RES0201]  (value not drawn)
FR90  600R, 0.27A  [RES0201]  (value not drawn)
FR91  600R, 0.27A  [RES0201]  (value not drawn)
FR92  600R, 0.27A  [RES0201]  (value not drawn)
FR93  600R, 0.27A  [RES0201]  (value not drawn)
FR94  600R, 0.27A  [RES0201]  (value not drawn)
FR95  600R, 0.27A  [RES0201]  (value not drawn)
FR96  600R, 0.27A  [RES0201]  (value not drawn)
FR97  600R, 0.27A  [RES0201]  (value not drawn)
FR98  600R, 0.27A  [RES0201]  (value not drawn)
FR99  600R, 0.27A  [RES0201]  (value not drawn)
IC5  LMS7002M  [LMS7002M_v5]  (parts E,F,G of 7)
R99  0R  Assembly Info: NF  [RES0402]
R100  0R  [RES0402]
R101  10R  [RES0201]
R102  10R  [RES0201]
R103  0R  [RES0201]
R104  0R  [RES0402]
R105  0R  [RES0402]
R106  0R  [RES0402]
R107  0R  [RES0402]
R108  0R  [RES0402]
R109  10R  [RES0201]
R110  10R  [RES0201]

### Blocks framed on the sheet
Only one is fitted: R99 R100

### Nets
GND: C200.2 C201.2 C202.2 C203.2 C204.2 C205.1 C206.2 C207.2 C208.2 C209.2 C210.2 C211.2 C212.2 C213.2 C214.2 C215.2 C216.2 C217.2 C218.1 C219.2 C220.2 C221.2 C222.2 C223.2 C224.2 C225.1 C226.2 C227.1 C228.1 C229.2 C230.2 C231.2 C232.2 C233.2 C234.2 C235.2 C236.1 C237.2 C238.2 C239.2 C240.2 C241.2 C242.2 C243.2 C244.2 C245.2 C246.2 C247.2 C248.2 C249.2 C250.2 C251.2 C252.2 C253.2 C254.2 C255.2 C256.2 C257.2 C258.2 IC5.AA31(DIGPRGND1) IC5.AF32(DIGPRGND2) IC5.AG29(DIGPRGND1) IC5.AJ19(GND_CP_SXR) IC5.AK20(GND_DIV_SXR) IC5.AL23(GND_VCO_SXR) IC5.AM22(DGND_SXR) IC5.AN25(GND_RXBUF) IC5.B18(DGND_CGEN) IC5.B20(GND_CP_CGEN) IC5.C7(GND_TLOBUF_TRF) IC5.C23(GND_DIG) IC5.D20(GND_DIV_CGEN) IC5.E25(GND_SPI_BUF) IC5.F6(GND_TXBUF) IC5.G31(DIGPRGND2) IC5.GND(EP) IC5.H2(GND_VCO_SXT) IC5.J33(DIGPRGND1) IC5.K4(GND_CP_SXT) IC5.L3(GND_DIV_SXT) IC5.N3(DGND_SXT) IC5.T30(DIGPRGND1,2) IC5.W29(DIGPRGND1) IC5.Y30(DIGPRGND2)
VCC1P4_LMS3: FR84.2 FR85.2 FR86.2 FR87.2 FR88.2 FR89.2 R99.1
VCC1P8_LMS3: FR90.2 FR91.1 FR92.1 FR93.2 FR94.2 FR95.2 FR96.2 FR97.2 R103.2 R109.2 R110.1
VCC1P25_LMS3: FR67.2 FR68.2 FR69.2 FR70.2 FR71.2 FR72.2 FR73.2 FR74.2 FR75.2 FR76.2 FR77.2 FR78.2 FR79.2 FR80.2 FR81.2 FR82.2 FR83.2 R100.1
VDIO_LMS: C236.2 R104.1 R105.1 R106.1 R107.1 R108.1
NetC200_1: C200.1 C201.1 C207.1 C208.1 C209.1 C210.1 C211.1 C212.1 IC5.AA29(DIGPRVDD1) IC5.AE29(DIGPRVDD1) IC5.L33(DIGPRVDD1) IC5.R31(DIGPRVDD1) R99.2 R100.2
NetC202_1: C202.1 C203.1 C204.1 FR69.1 IC5.A17(DVDD_CGEN) IC5.C25(VDD12_DIG) IC5.F24(VDD_SPI_BUF)
NetC205_2: C205.2 FR68.1 IC5.M4(DVDD_SXT)
NetC206_1: C206.1 FR67.1 IC5.AL21(DVDD_SXR)
NetC213_1: C213.1 IC5.G5(VDD12_TXBUF) R101.1
NetC214_1: C214.1 FR72.1 IC5.P4(VDD_TBB)
NetC215_1: C215.1 FR83.1 IC5.D6(VDDO_TLOBUF_TRF) IC5.F8(VDD_TLOBUF_TRF)
NetC216_1: C216.1 FR82.1 IC5.B16(VDD_TPAD_TRF)
NetC217_1: C217.1 FR81.1 IC5.E19(VDD_DIV_CGEN)
NetC218_2: C218.2 FR80.1 IC5.F20(VDD_CP_CGEN)
NetC219_1: C219.1 FR79.1 IC5.AJ25(VDD_AFE)
NetC220_1: C220.1 IC5.AP26(VDD12_RXBUF) R102.1
NetC221_1: C221.1 FR77.1 IC5.AN23(VDD12_VCO_SXR)
NetC222_1: C222.1 FR76.1 IC5.AM20(VDD_DIV_SXR)
NetC223_1: C223.1 FR75.1 IC5.AL19(VDD_CP_SXR)
NetC224_1: C224.1 FR74.1 IC5.AG5(VDD12_LNA_RFE)
NetC225_2: C225.2 FR73.1 IC5.AD6(VDD12_TIA_RFE)
NetC226_1: C226.1 FR71.1 IC5.J3(VDD_CP_SXT)
NetC227_2: C227.2 FR70.1 IC5.J5(VDD12O_VCO_SXT) IC5.K6(VDD12_VCO_SXT)
NetC228_2: C228.2 FR78.1 R101.2 R102.2
NetC229_1: C229.1 FR84.1 IC5.K2(VDDO_DIV_SXT) IC5.L5(VDD_DIV_SXT)
NetC230_1: C230.1 FR89.1 IC5.C21(VDD14_VCO_CGEN)
NetC231_1: C231.1 FR88.1 IC5.AF6(VDD14_LNA_RFE)
NetC232_1: C232.1 FR87.1 IC5.AF2(VDD14_TIA_RFE)
NetC233_1: C233.1 FR86.1 IC5.AD4(VDD14_RBB)
NetC234_1: C234.1 FR85.1 IC5.AN17(VDD_MXLOBUF_RFE)
NetC235_1: C235.1 IC5.D24(VDD18_DIG) R103.1
NetC237_1: C237.1 C238.1 IC5.W31(DIGPRPOC) R108.2
NetC239_1: C239.1 C240.1 IC5.H32(DIGPRVDD2) R107.2
NetC241_1: C241.1 C242.1 IC5.T32(DIGPRVDD2) R106.2
NetC243_1: C243.1 C244.1 IC5.W33(DIGPRVDD2) R105.2
NetC245_1: C245.1 C246.1 IC5.AH30(DIGPRVDD2) R104.2
NetC247_1: C247.1 FR90.1 IC5.G3(VDD18_VCO_SXT)
NetC248_1: C248.1 FR97.1 IC5.E21(VDD18_VCO_CGEN)
NetC249_1: C249.1 FR96.1 IC5.D16(VDD18_TRF)
NetC250_1: C250.1 FR95.1 IC5.E17(VDD18_BIAS)
NetC251_1: C251.1 FR94.1 IC5.AK22(VDD18_VCO_SXR)
NetC252_1: C252.1 FR93.1 IC5.AM18(VDD18_SXR)
NetC253_1: C253.1 FR92.2 IC5.AE3(VDD18_TIA_RFE) IC5.AF4(VDD18_LDO_RX)
NetC254_1: C254.1 FR91.2 IC5.N1(VDD18_LDO_TX)
NetC255_1: C255.1 FR99.1 IC5.AM26(VDD18_RXBUF)
NetC256_1: C256.1 FR98.2 IC5.H6(VDD18_TXBUF)
NetC257_1: C257.1 FR99.2 R110.2
NetC258_1: C258.1 FR98.1 R109.1

### Notes on the sheet
- NF elements on sheet: R99
- Number of NF elements on sheet: 1
- LMS7002M power supply circuit (LMS3)
- (near R99) NF
- (near FR83) All ferrites are
- 600R, 0.27A
- (near FR89) All ferrites are
- (near FR89) 600R, 0.27A
- Project name:
- Title:
- Version:
- Date:
- Variant:
- Time:
- Sheet
- of
- File:
- Size:
- A3
- (in symbol LMS7002Mr4, part E) LMS7002M Power; Part 5/7; 1.8V Digital; 1.8V-3.3V Digital; 1.8V Analog; 1.8V-3.3V Analog
- (in symbol LMS7002Mr4, part F) LMS7002M Power; Part 6/7; 1.25V Digital; 1.25V Analog; 1.25V-1.4V Analog; 1.4V Analog
- (in symbol LMS7002Mr4, part G) LMS7002M GND; Part 7/7; Digital gnd; Analog gnd; Thermal pad

### Library data of the parts
C200 C202-C207 C209 C211 C213-C235 C238 C240 C242 C244 C246-C258 = Cap_0402: as C82 on sheet 11_LMS1_Power; Supplier 1: Digi-Key; Supplier Part Number 1: 587-5864-2-ND; Applications: General Purpose; Features: -; Lead Style: -; Ratings: -; Thickness (Max): -; Lead Spacing: -; Height - Seated (Max): -; Size / Dimension: 0.024" L x 0.012" W (0.60mm x 0.30mm); Mounting Type: Surface Mount, MLCC; Operating Temperature: -55°C ~ 85°C; Package / Case: 0201 (0603 Metric); Packaging: Cut Tape (CT); Voltage - Rated: 6.3V; Category: Capacitors; RoHS: RoHS Compliant
C201 C208 C210 C212 C237 C239 C241 C243 C245 = Cap_0402: as C83 on sheet 11_LMS1_Power; Value: 1nF, 10%; Supplier 1: Digi-Key; Supplier Part Number 1: 445-7275-1-ND; Features: -; Package / Case: 0201 (0603 Metric); Lead Spacing: -; Mounting Type: Surface Mount, MLCC; Lead Style: -; Height - Seated (Max): -; Operating Temperature: -55°C ~ 125°C; Tolerance: ±10%; Size / Dimension: 0.024" L x 0.012" W (0.60mm x 0.30mm); Applications: General Purpose; Ratings: -; Thickness (Max): 0.013" (0.33mm); RoHS: RoHS Compliant; Packaging: Cut Tape (CT); Category: Capacitors
C236 = Cap_0603: as C118 on sheet 11_LMS1_Power; Supplier 1: Digi-Key; Supplier Part Number 1: 311-1448-2-ND; Package / Case: 0603 (1608 Metric); Category: Capacitors; Voltage - Rated: 6.3V; Value: 10uF, 6.3V
FR67-FR99 = Ferrite: as FR1 on sheet 11_LMS1_Power; Supplier 1: Digi-Key; Supplier Part Number 1: 587-3277-1-ND; Size / Dimension: 0.024" L x 0.012" W (0.60mm x 0.30mm); Package / Case: 0201 (0603 Metric); Height (Max): 0.013" (0.33mm); Mounting Type: Surface Mount; Packaging: Cut Tape (CT); RoHS: RoHS Compliant; Category: Filters
IC5 = LMS7002Mr4: as IC3 on sheet 09_LMS2_RF; Supplier 1: Lime Microsystems; Supplier Part Number 1: LMS7002M; Manufacturer Part Number 1: LMS7002M
R99 R100 R104-R108 = Res_0402: as R75 on sheet 11_LMS1_Power; Value: 0R; Supplier 1: Digi-Key; Supplier Part Number 1: 311-0.0JRTR-ND; Category: Resistors; Temperature Coefficient: -; Features: Moisture Resistant; Supplier Device Package: 0402; Height: 0.016" (0.40mm); Package / Case: 0402 (1005 Metric); Operating Temperature: -55°C ~ 155°C; Size / Dimension: 0.039" L x 0.020" W (1.00mm x 0.50mm); Composition: Thick Film; Packaging: Tape & Reel (TR); Number of Terminations: 2; RoHS: RoHS Compliant
R101 R102 R109 R110 = Res_0402: as R77 on sheet 11_LMS1_Power; Value: 10R; Supplier 1: Digi-Key; Supplier Part Number 1: P10.0ABCT-ND; Package / Case: 0201 (0603 Metric); Height: 0.010" (0.26mm); Supplier Device Package: 0201; Packaging: Cut Tape (CT); Composition: Thick Film; Category: Resistors; Number of Terminations: 2; Size / Dimension: 0.024" L x 0.012" W (0.60mm x 0.30mm); Operating Temperature: -55°C ~ 125°C; Features: -; RoHS: RoHS Compliant
R103 = Res_0402: as R79 on sheet 11_LMS1_Power; Value: 0R; Supplier 1: Digi-Key; Supplier Part Number 1: 311-0.0MCT-ND; Number of Terminations: 2; Operating Temperature: -55°C ~ 125°C; Package / Case: 0201 (0603 Metric); Height: 0.010" (0.26mm); Supplier Device Package: 0201 (0603 Metric); Size / Dimension: 0.024" L x 0.012" W (0.60mm x 0.30mm); Temperature Coefficient: -; Category: Resistors; Features: -; RoHS: RoHS Compliant; Composition: Thick Film; Packaging: Cut Tape (CT)